# Altium schematic sheet POWER1.SchDoc
size A; SheetNumber: 2; SheetTotal: 7
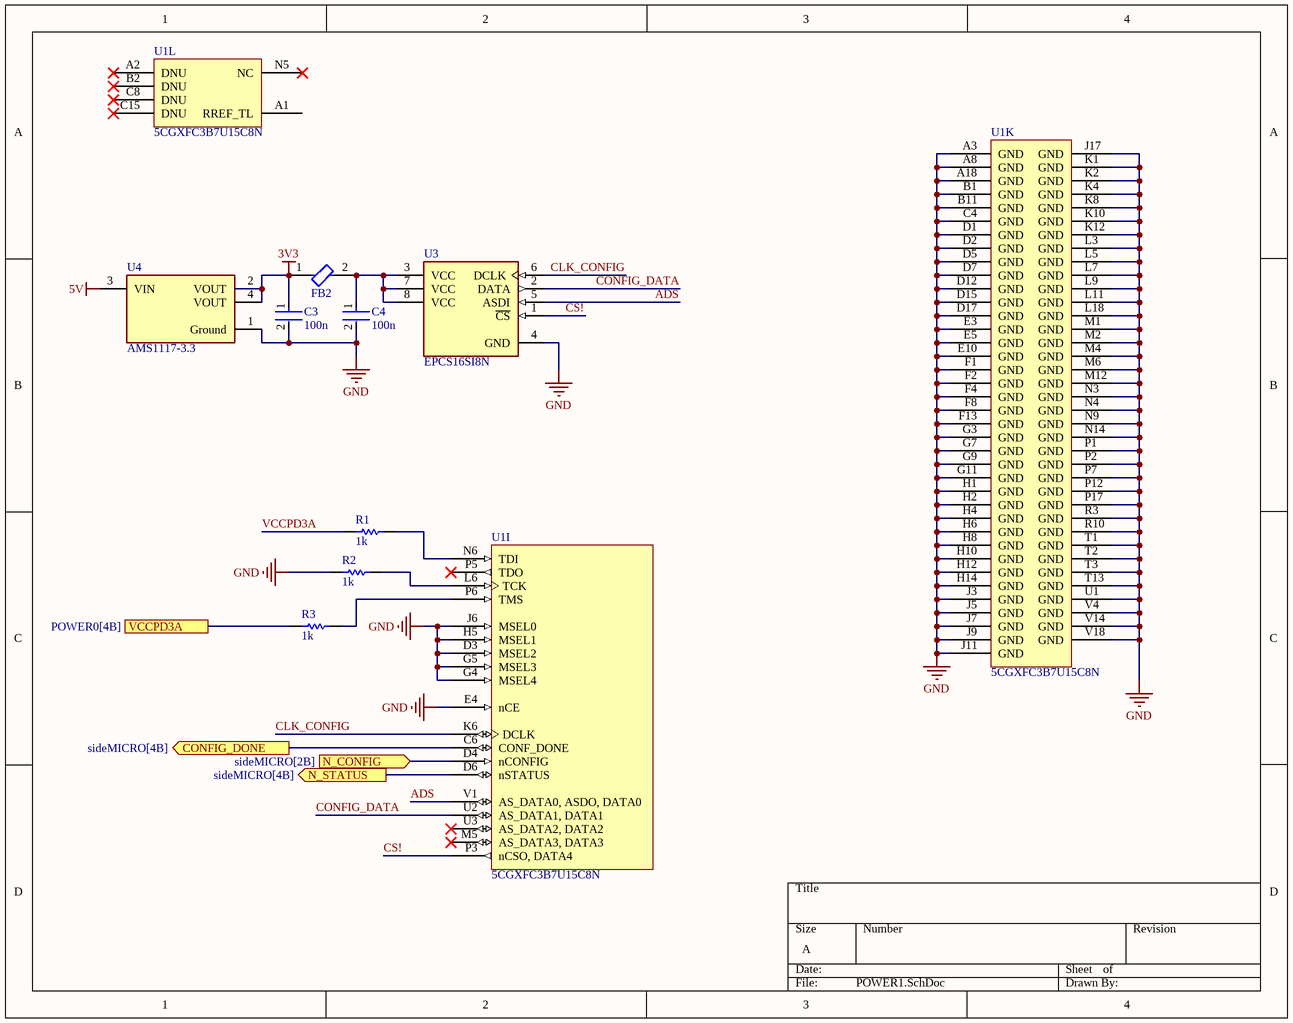
[diagram p0: POWER1.SchDoc]

## Parts
C3  100n  [FP-CL10-IPC_C]
C4  100n  [FP-CL10-IPC_C]
FB2  BLM18KG121TN1D  [FP-BLM18-0_15-t0_6-d1_2-IPC_A]  (value not drawn)
R1  1k  [RESC2013X60X35ML10T20]
R2  1k  [RESC2013X60X35ML10T20]
R3  1k  [RESC2013X60X35ML10T20]
U1  5CGXFC3B7U15C8N  [ALTR-UBGA324_A-150]  (parts I,K,L of 12)
U3  EPCS16SI8N  [FP-SOIC-8-IPC_C]
U4  AMS1117-3.3  [FP-AMS1117-IPC_C]

## Ports
CONFIG_DONE (out, see sideMICRO[4B]), N_CONFIG (in, see sideMICRO[2B]), N_STATUS (out, see sideMICRO[4B]), VCCPD3A (see POWER0[4B])

## Nets
3V3: C3.1 FB2.1 U4.2(VOUT) U4.4(VOUT)
5V: U4.3(VIN)
GND: C3.2 C4.2 R2.1 U1.A3(GND) U1.A8(GND) U1.A18(GND) U1.B1(GND) U1.B11(GND) U1.C4(GND) U1.D1(GND) U1.D2(GND) U1.D3(MSEL2) U1.D5(GND) U1.D7(GND) U1.D12(GND) U1.D15(GND) U1.D17(GND) U1.E3(GND) U1.E4(nCE) U1.E5(GND) U1.E10(GND) U1.F1(GND) U1.F2(GND) U1.F4(GND) U1.F8(GND) U1.F13(GND) U1.G3(GND) U1.G4(MSEL4) U1.G5(MSEL3) U1.G7(GND) U1.G9(GND) U1.G11(GND) U1.H1(GND) U1.H2(GND) U1.H4(GND) U1.H5(MSEL1) U1.H6(GND) U1.H8(GND) U1.H10(GND) U1.H12(GND) U1.H14(GND) U1.J3(GND) U1.J5(GND) U1.J6(MSEL0) U1.J7(GND) U1.J9(GND) U1.J11(GND) U1.J17(GND) U1.K1(GND) U1.K2(GND) U1.K4(GND) U1.K8(GND) U1.K10(GND) U1.K12(GND) U1.L3(GND) U1.L5(GND) U1.L7(GND) U1.L9(GND) U1.L11(GND) U1.L18(GND) U1.M1(GND) U1.M2(GND) U1.M4(GND) U1.M6(GND) U1.M12(GND) U1.N3(GND) U1.N4(GND) U1.N9(GND) U1.N14(GND) U1.P1(GND) U1.P2(GND) U1.P7(GND) U1.P12(GND) U1.P17(GND) U1.R3(GND) U1.R10(GND) U1.T1(GND) U1.T2(GND) U1.T3(GND) U1.T13(GND) U1.U1(GND) U1.V4(GND) U1.V14(GND) U1.V18(GND) U3.4(GND) U4.1(Ground)
ADS: U1.V1(AS_DATA0,_ASDO,_DATA0) U3.5(ASDI)
CLK_CONFIG: U1.K6(DCLK) U3.6(DCLK)
CONFIG_DATA: U1.U2(AS_DATA1,_DATA1) U3.2(DATA)
CONFIG_DONE: U1.C6(CONF_DONE) ; port CONFIG_DONE
CS!: U1.P3(nCSO,_DATA4) U3.1(~{CS})
N_CONFIG: U1.D4(nCONFIG) ; port N_CONFIG
N_STATUS: U1.D6(nSTATUS) ; port N_STATUS
VCCPD3A: R1.1
VCCPD3A: R3.1 ; port VCCPD3A  [a separate net that carries the same name]
NetC4_1: C4.1 FB2.2 U3.3(VCC) U3.7(VCC) U3.8(VCC)
NetR1_2: R1.2 U1.N6(TDI)
NetR2_2: R2.2 U1.L6(TCK)
NetR3_2: R3.2 U1.P6(TMS)

Not connected (* = marked no-connect by the designer): U1 A1(RREF_TL) A2(DNU)* B2(DNU)* C8(DNU)* C15(DNU)* M5(AS_DATA3,_DATA3)* N5(NC)* P5(TDO)* U3(AS_DATA2,_DATA2)*

## Library data of the parts
C3 C4 = CMP-13271-003017-1: Cap Ceramic 4.7uF 10V X5R ±10% Pad SMD 0603 +85°C T/R; Capacitance: 4.7uF; Case/Package: 0603; Packaging: Tape and Reel; Width: 0.031inch; Contact Plating: Tin; Thickness: 0.035inch; Package Quantity: 1; Voltage Rating: 10V; Case Code (Metric): 1608; Case Code (Imperial): 0603; Depth: 0.8mm; Height: 0.8mm; Tolerance: 10%; Max Operating Temperature: 85°C; Length: 1.6mm; Dielectric: X5R; Mount: Surface Mount; Radiation Hardening: No; Min Operating Temperature: -55°C
FB2 = CMP-0686-00554-8: FERRITE BEAD 120 OHM 0603 1LN; Max Current Rating: 3A; DC Resistance (DCR): 30mR; Impedance: 120R; Number of Lines: 1; Test Frequency: 100MHz; Tolerance: 25%; Package Quantity: 4000; Min Operating Temperature: -55°C; Termination: SMD/SMT; REACH SVHC: No SVHC; Core Material: Ferrite; Material: Ferrite; Current Rating: 3A; Height: 0.8mm; Number of Pins: 2; Case/Package: 0603; Case Code (Imperial): 0603; Series: BLM18K; Packaging: Tape and Reel; Inductor Type: FERRITE BEAD; Lead Free: Lead Free; Width: 0.8mm; Case Code (Metric): 1608; Number of Circuits: 1; Max DC Current: 3A; Depth: 0.95mm; Max Operating Temperature: 125°C; Length: 1.6mm; RoHS Compliant: Yes
R1-R3 = CMP-2100-03673-1: Chip Resistor, 0 Ohm, Jumper, +/- 5%, 0.125 W, -55 to 155 degC, 0805 (2012 Metric), RoHS, Tape and Reel; Manufacturer: Yageo; Power Rating: 125mW; Resistance: 0mOhm; Voltage Rating (DC): 150V; Temperature Coefficient: 200ppm/degreesC; Height: 0.5mm; Depth: 1.25mm; Case Code (Imperial): 0805; Lead Free: LeadFree; Military Standard: Not; Package Description: 2-Pin Surface Mounted Device, Body 2 x 1.25 mm; Case Code (Metric): 2012; Composition: ThickFilm; Voltage Rating: 150V; Manufacturer URL: http://www.yageo.com/; Packaging: TapeandReel; Package Reference: 0805; REACH SVHC: Unknown; Tolerance: 5%; Case/Package: 0805; Max Operating Temperature: 155degC; Number of Pins: 2; Min Operating Temperature: -55degC; RoHSCompliant: true; Length: 2mm; Datasheet URL: http://www.yageo.com/NewPortal/yageodocoutput?fileName=/pdf/R-Chip/PYu-RC_Group_51_RoHS_L_5.pdf; Termination: SMD/SMT; Radiation Hardening: No; Width: 1.25mm; Contact Plating: Tin; Datasheet Version: Rev. 5, 10/2016
U1 = CMP-0469-00059-2: Cyclone V GX Family FPGA, 1.07 to 1.13 V Supply, 144 I/O Pins, 4 PLLs, 324-Pin UBGA, Speed Grade 8, Commercial Grade, RoHS Compliant; Manufacturer: Altera; Logic Elements (LE) (K): 31.5; GPIO: 144; Speed Grade: 8; ComponentLink1Description: Manufacturer URL; ComponentLink5URL: http://www.altera.com/literature/dp/cyclone-v/5CGXFC3.xls; ComponentLink7URL: http://www.buyaltera.com/scripts/partsearch.dll?Detail&name=544-2758-ND; Subcategory: Cyclone V GX; ComponentLink2Description: Datasheet; Voltage Supply: 1.07 to 1.13 V; PackageVersion: Rev. 1.0, 10/2011; ComponentLink7Description: Product URL; ComponentLink4Description: Device Handbook URL; Mounting Technology: Surface Mount; ComponentLink3URL: http://www.altera.com/devicepackaging/04R00433-00.pdf; Code_JEDEC: MO-216-BAK-1; ComponentLink1URL: http://www.altera.com; ComponentLink3Description: Package Specification; Device Group: 5CGXFC3; ComponentLink6URL: http://www.altera.com/literature/hb/cyclone-v/cv_51001.pdf; ComponentLink4URL: http://www.altera.com/literature/hb/cyclone-v/cyclone5_handbook.pdf; PackageDescription: 324-Pin Ultra FineLine Ball-Grid Array (UBGA), Body 15 x 15 mm, Pitch 0.8 mm; RoHS: RoHS Compliant; PackageReference: UBGA324_A-150; DatasheetVersion: Rev. 3.4; PartNumber: 5CGXFC3B7U15C8N; ComponentLink2URL: http://www.altera.com/literature/hb/cyclone-v/cv_51002.pdf; ComponentLink6Description: Device Overview URL; ComponentLink5Description: Device Pin-Out URL; NexusDeviceID: 5CGXFC3B7U15C8N
U3 = CMP-0215-00002-2: IC CONFIG DEVICE 16MBIT 8SOIC; Manufacturer: Intel; Obsolete Part: true; Interface: Other; Memory Type: FLASH; Nominal Supply Current: 15-20mA; Min Supply Voltage: 2.7V; Memory Size: 16Mbits; Max Junction Temp: +135°C; Standoff Height: 0.1mm; Frequency: 40MHz; Max Supply Voltage: 3.6V; Device Class L1: Integrated Circuits (ICs); Ambient Temperature Range Low: -40°C; Automotive: No; Ipc Land Pattern Name: SOIC127P600X155-8; Lead Free: Yes; Height: 1.75mm; Device Class L3: Flash; Temperature Range High: +135°C; Ambient Temperature Range High: +85°C; Manufacturer Part Number: EPCS16SI8N; ComponentLink2URL: https://www.intel.com/content/dam/www/programmable/us/en/pdfs/literature/hb/cfg/cyc_c51014.pdf; RoHS: TRUE; ComponentLink2Description: Datasheet; Digikey Description: IC CONFIG DEVICE 16MBIT 8SOIC; Octopart: https://octopart.com/epcs16si8n-intel-80907697; Package: SOIC-8; Temperature: to +135°C; Device Class L2: Memory; Footprint Url: https://www.intel.com/content/dam/www/programmable/us/en/pdfs/literature/packaging/04r00424-00.pdf; Category: IC; Mouser Description: FPGA - Configuration Memory IC - Ser. Config Mem Flash 16Mb 40 MHz
U4 = CMP-209535-000001-1: LDO Voltage Regulators 1A, 3.3V; Manufacturer: Advanced Monolithic Systems; Dropout Voltage: 1.1V; Output Type: Fixed; Nominal Supply Current: 5mA; Max Power Dissipation: 1.2W; Max Supply Voltage: 15V; Number Of Outputs: 1; Standoff Height: 0.64mm; Max Junction Temp: +125°C; Height: 1.8mm; Package: AMS1117; Device Class L2: Power Management ICs; ComponentLink2Description: Datasheet; ComponentLink2URL: http://www.advanced-monolithic.com/pdf/ds1117.pdf; Category: IC; RoHS: TRUE; Automotive: No; Device Class L1: Integrated Circuits (ICs); Output Current: 1A; Device Class L3: Voltage Regulators - Linear; Temperature: -40°C to +125°C; Output Voltage: 3.3V; Manufacturer Part Number: AMS1117-3.3; Temperature Range Low: -40°C; Octopart: https://octopart.com/ams1117-3.3-advanced+monolithic+systems-25899300; Lead Free: Yes; Ipc Land Pattern Name: SOT229P700X180-4; Temperature Range High: +125°C